# EAGLE schematic slice (EAGLE 5.11)

## Sheet 1 of 6
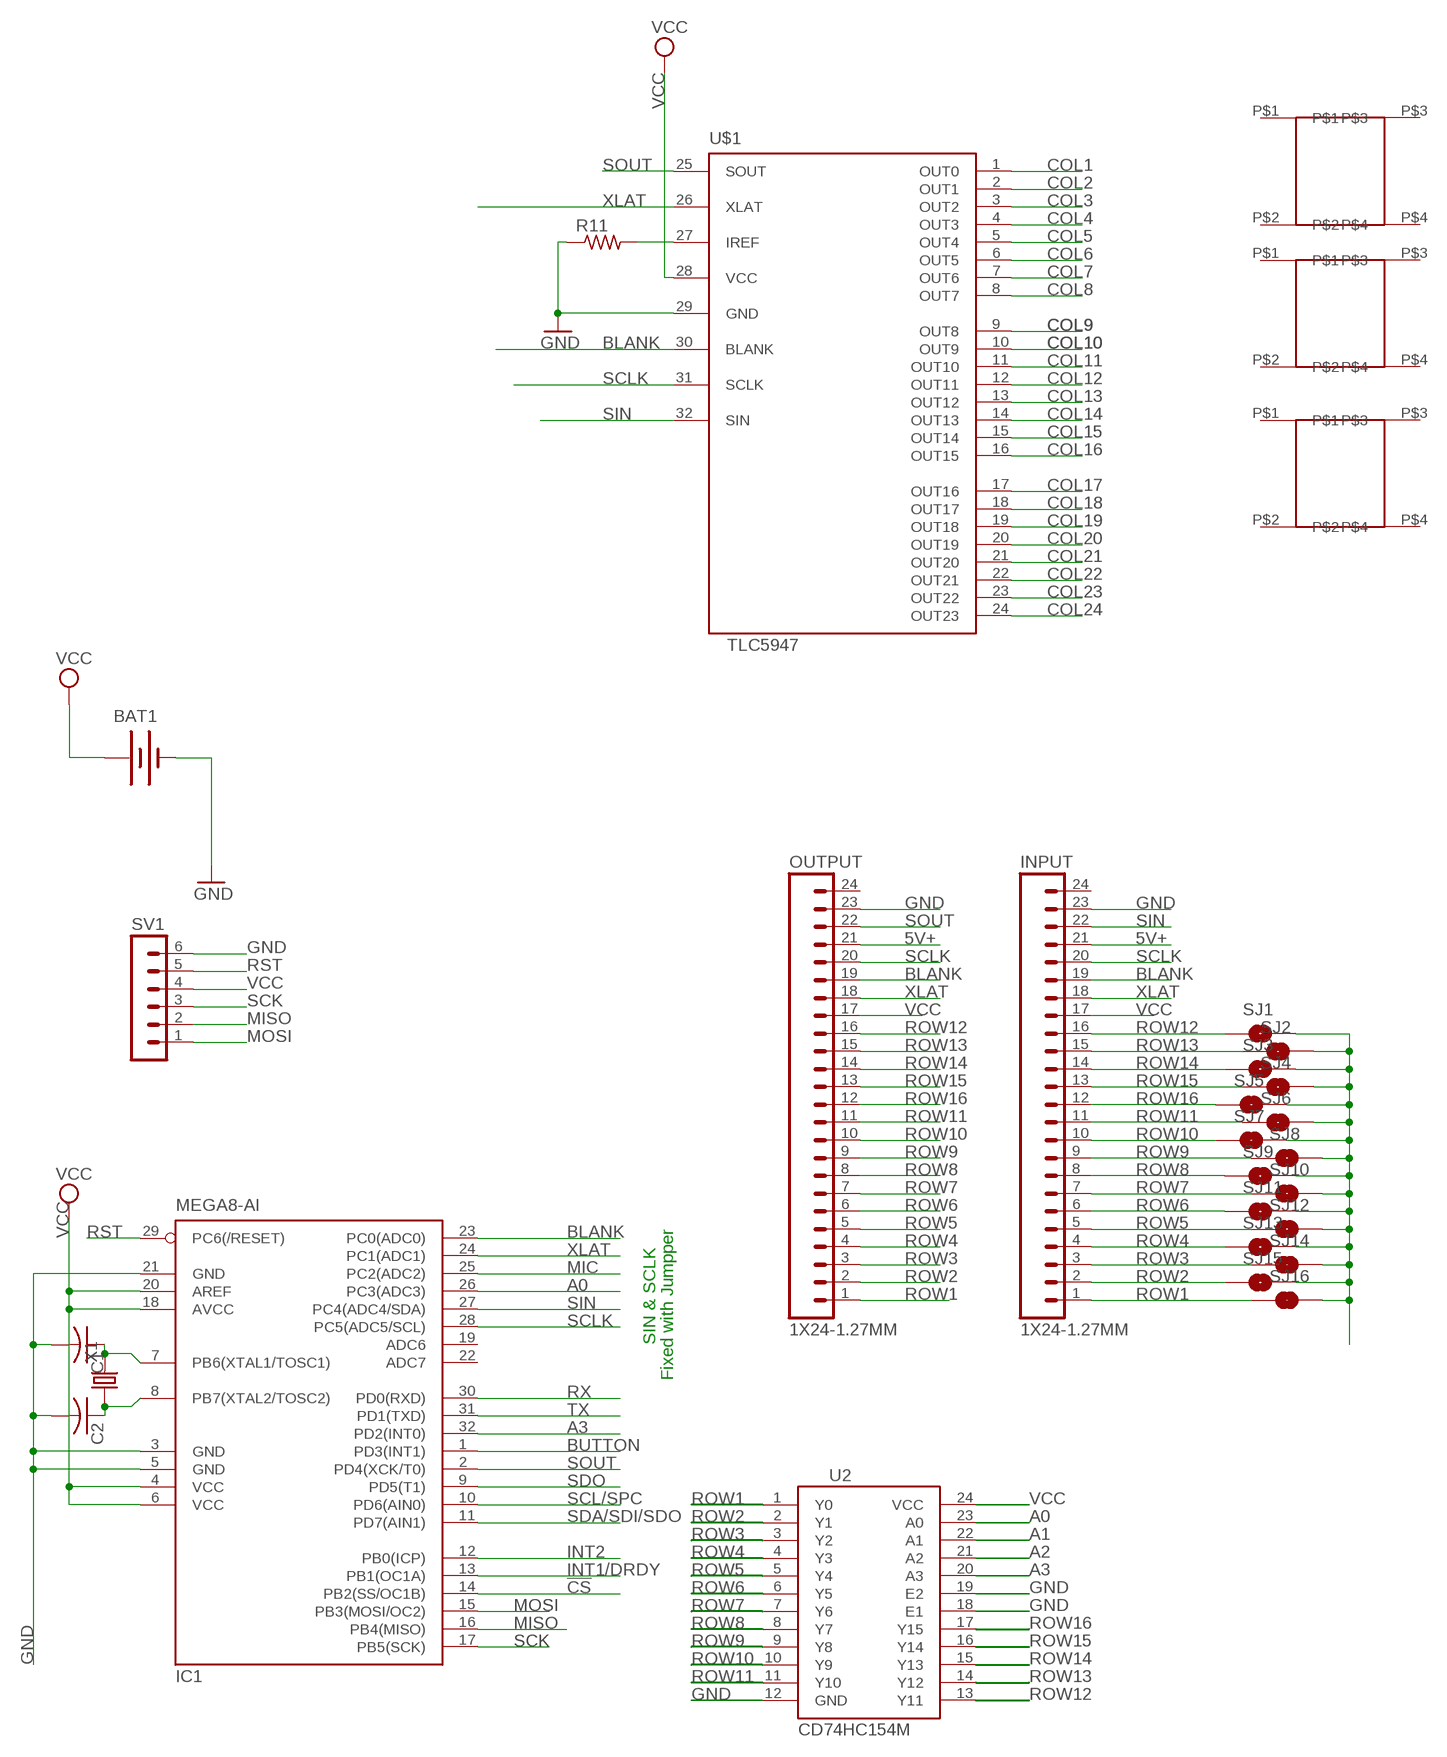
[diagram p0: schematic, sheet 1]

### Parts
BAT1  BATTERY20SMD  [BATTCON_20MM]
C1  C-USC0805  [C0805]
C2  C-USC0805  [C0805]
IC1  MEGA8-AI  [TQFP32-08]
INPUT  1X24-1.27MM  [1X24-1.27MM]
OUTPUT  1X24-1.27MM  [1X24-1.27MM]
R11  R-US_R1206  [R1206]
SJ1  SOLDERJUMPERNO  [SJ_2S-NO]
SJ2  SOLDERJUMPERNO  [SJ_2S-NO]
SJ3  SOLDERJUMPERNO  [SJ_2S-NO]
SJ4  SOLDERJUMPERNO  [SJ_2S-NO]
SJ5  SOLDERJUMPERNO  [SJ_2S-NO]
SJ6  SOLDERJUMPERNO  [SJ_2S-NO]
SJ7  SOLDERJUMPERNO  [SJ_2S-NO]
SJ8  SOLDERJUMPERNO  [SJ_2S-NO]
SJ9  SOLDERJUMPERNO  [SJ_2S-NO]
SJ10  SOLDERJUMPERNO  [SJ_2S-NO]
SJ11  SOLDERJUMPERNO  [SJ_2S-NO]
SJ12  SOLDERJUMPERNO  [SJ_2S-NO]
SJ13  SOLDERJUMPERNO  [SJ_2S-NO]
SJ14  SOLDERJUMPERNO  [SJ_2S-NO]
SJ15  SOLDERJUMPERNO  [SJ_2S-NO]
SJ16  SOLDERJUMPERNO  [SJ_2S-NO]
SV1  MA06-1  [MA06-1]
U2  CD74HC154M  [SO-24DW]
U$1  TLC5947  [QFN32]
U$2  SLOT  [SLOT]
U$3  SLOT  [SLOT]
U$4  SLOT  [SLOT]
X1  CRYSTAL-5032  [5032]

### Nets
5V+: INPUT.21 OUTPUT.21 ; also sheet 2,4
!CS: IC1.14(PB2(SS/OC1B)) ; also sheet 3
A0: IC1.26(PC3(ADC3)) U2.23(A0)
A1: U2.22(A1)
A2: U2.21(A2)
A3: IC1.32(PD2(INT0)) U2.20(A3)
BLANK: IC1.23(PC0(ADC0)) INPUT.19 OUTPUT.19 U$1.30(BLANK)
BUTTON: IC1.1(PD3(INT1)) ; also sheet 3
COL1: U$1.1(OUT0) ; also sheet 2
COL2: U$1.2(OUT1) ; also sheet 2
COL3: U$1.3(OUT2) ; also sheet 2
COL4: U$1.4(OUT3) ; also sheet 2
COL5: U$1.5(OUT4) ; also sheet 2
COL6: U$1.6(OUT5) ; also sheet 2
COL7: U$1.7(OUT6) ; also sheet 2
COL8: U$1.8(OUT7) ; also sheet 2
COL9: U$1.9(OUT8) ; also sheet 2
COL10: U$1.10(OUT9) ; also sheet 2
COL11: U$1.11(OUT10) ; also sheet 2
COL12: U$1.12(OUT11) ; also sheet 2
COL13: U$1.13(OUT12) ; also sheet 2
COL14: U$1.14(OUT13) ; also sheet 2
COL15: U$1.15(OUT14) ; also sheet 2
COL16: U$1.16(OUT15) ; also sheet 2
COL17: U$1.17(OUT16) ; also sheet 2
COL18: U$1.18(OUT17) ; also sheet 2
COL19: U$1.19(OUT18) ; also sheet 2
COL20: U$1.20(OUT19) ; also sheet 2
COL21: U$1.21(OUT20) ; also sheet 2
COL22: U$1.22(OUT21) ; also sheet 2
COL23: U$1.23(OUT22) ; also sheet 2
COL24: U$1.24(OUT23) ; also sheet 2
GND: BAT1.2(-) C1.2 C2.2 IC1.3(GND) IC1.5(GND) IC1.21(GND) INPUT.23 OUTPUT.23 R11.1 SV1.6 U2.12(GND) U2.18(E1) U2.19(E2) U$1.29(GND) ; also sheet 3,4,5,6
INT1/DRDY: IC1.13(PB1(OC1A)) ; also sheet 3
INT2: IC1.12(PB0(ICP)) ; also sheet 3
MIC: IC1.25(PC2(ADC2)) ; also sheet 6
MISO: IC1.16(PB4(MISO)) SV1.2
MOSI: IC1.15(PB3(MOSI/OC2)) SV1.1
N$7: C1.1 IC1.7(PB6(XTAL1/TOSC1)) X1.2
N$8: C2.1 IC1.8(PB7(XTAL2/TOSC2)) X1.1
N$13: R11.2 U$1.27(IREF)
ROW: SJ1.2 SJ2.2 SJ3.2 SJ4.2 SJ5.2 SJ6.2 SJ7.2 SJ8.2 SJ9.2 SJ10.2 SJ11.2 SJ12.2 SJ13.2 SJ14.2 SJ15.2 SJ16.2 ; also sheet 2
ROW1: INPUT.1 OUTPUT.1 SJ16.1 U2.1(Y0)
ROW2: INPUT.2 OUTPUT.2 SJ15.1 U2.2(Y1)
ROW3: INPUT.3 OUTPUT.3 SJ14.1 U2.3(Y2)
ROW4: INPUT.4 OUTPUT.4 SJ13.1 U2.4(Y3)
ROW5: INPUT.5 OUTPUT.5 SJ12.1 U2.5(Y4)
ROW6: INPUT.6 OUTPUT.6 SJ11.1 U2.6(Y5)
ROW7: INPUT.7 OUTPUT.7 SJ10.1 U2.7(Y6)
ROW8: INPUT.8 OUTPUT.8 SJ9.1 U2.8(Y7)
ROW9: INPUT.9 OUTPUT.9 SJ8.1 U2.9(Y8)
ROW10: INPUT.10 OUTPUT.10 SJ7.1 U2.10(Y9)
ROW11: INPUT.11 OUTPUT.11 SJ6.1 U2.11(Y10)
ROW12: INPUT.16 OUTPUT.16 SJ1.1 U2.13(Y11)
ROW13: INPUT.15 OUTPUT.15 SJ2.1 U2.14(Y12)
ROW14: INPUT.14 OUTPUT.14 SJ3.1 U2.15(Y13)
ROW15: INPUT.13 OUTPUT.13 SJ4.1 U2.16(Y14)
ROW16: INPUT.12 OUTPUT.12 SJ5.1 U2.17(Y15)
RST: IC1.29(PC6(/RESET)) SV1.5
RX: IC1.30(PD0(RXD)) ; also sheet 5
SCK: IC1.17(PB5(SCK)) SV1.3
SCL/SPC: IC1.10(PD6(AIN0)) ; also sheet 3
SCLK: IC1.28(PC5(ADC5/SCL)) INPUT.20 OUTPUT.20 U$1.31(SCLK)
SDA/SDI/SDO: IC1.11(PD7(AIN1)) ; also sheet 3
SDO: IC1.9(PD5(T1)) ; also sheet 3
SIN: IC1.27(PC4(ADC4/SDA)) INPUT.22 U$1.32(SIN)
SOUT: IC1.2(PD4(XCK/T0)) OUTPUT.22 U$1.25(SOUT)
TX: IC1.31(PD1(TXD)) ; also sheet 5
VCC: BAT1.1(+) IC1.4(VCC) IC1.6(VCC) IC1.18(AVCC) IC1.20(AREF) INPUT.17 OUTPUT.17 SV1.4 U2.24(VCC) U$1.28(VCC) ; also sheet 3,4,6
XLAT: IC1.24(PC1(ADC1)) INPUT.18 OUTPUT.18 U$1.26(XLAT)
Unconnected: IC1.19(ADC6) IC1.22(ADC7) INPUT.24 OUTPUT.24 U$2.P$1 U$2.P$2 U$2.P$3 U$2.P$4 U$3.P$1 U$3.P$2 U$3.P$3 U$3.P$4 U$4.P$1 U$4.P$2 U$4.P$3 U$4.P$4

### Notes on the sheet
- SIN & SCLK
- Fixed with Jumpper

## Sheet 2 of 6
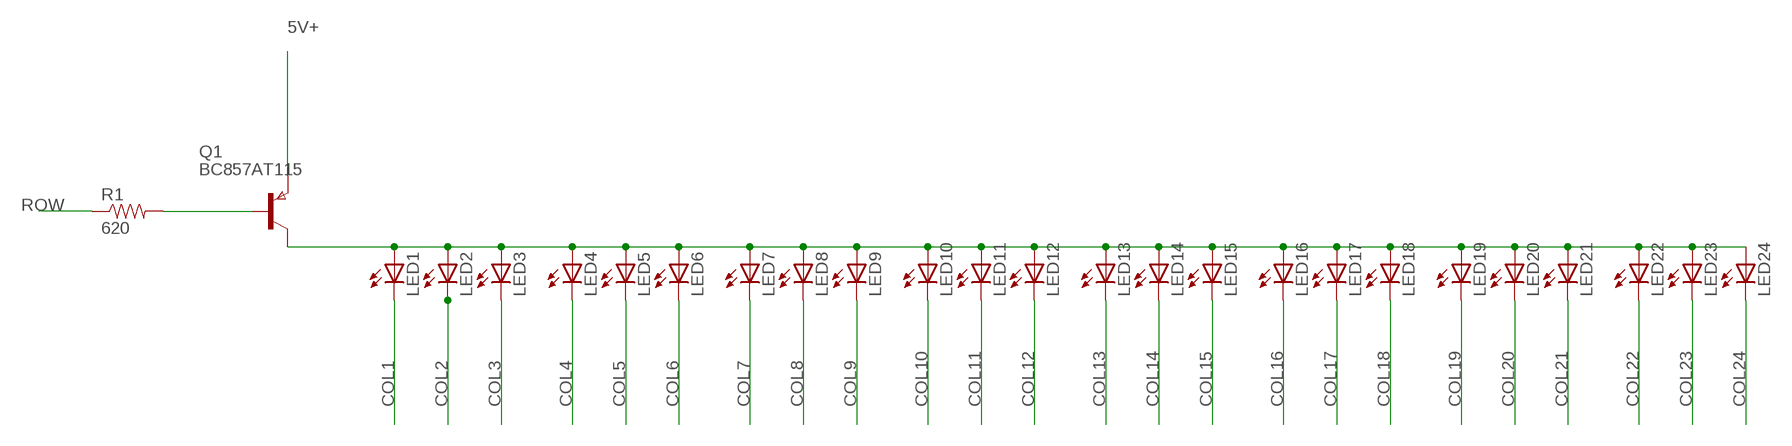
[diagram p1: schematic, sheet 2]

### Parts
LED1  LEDIRL80A  [IRL80A]
LED2  LEDIRL80A  [IRL80A]
LED3  LEDIRL80A  [IRL80A]
LED4  LEDIRL80A  [IRL80A]
LED5  LEDIRL80A  [IRL80A]
LED6  LEDIRL80A  [IRL80A]
LED7  LEDIRL80A  [IRL80A]
LED8  LEDIRL80A  [IRL80A]
LED9  LEDIRL80A  [IRL80A]
LED10  LEDIRL80A  [IRL80A]
LED11  LEDIRL80A  [IRL80A]
LED12  LEDIRL80A  [IRL80A]
LED13  LEDIRL80A  [IRL80A]
LED14  LEDIRL80A  [IRL80A]
LED15  LEDIRL80A  [IRL80A]
LED16  LEDIRL80A  [IRL80A]
LED17  LEDIRL80A  [IRL80A]
LED18  LEDIRL80A  [IRL80A]
LED19  LEDIRL80A  [IRL80A]
LED20  LEDIRL80A  [IRL80A]
LED21  LEDIRL80A  [IRL80A]
LED22  LEDIRL80A  [IRL80A]
LED23  LEDIRL80A  [IRL80A]
LED24  LEDIRL80A  [IRL80A]
Q1  BC857AT115  PNPSOT323SOT416  [SOT416]
R1  620  SPARKFUN_RESISTOR0603-RES  [SPARKFUN_0603-RES]

### Nets
5V+: Q1.3(E) ; also sheet 1,4
COL1: LED1.K(C) ; also sheet 1
COL2: LED2.K(C) ; also sheet 1
COL3: LED3.K(C) ; also sheet 1
COL4: LED4.K(C) ; also sheet 1
COL5: LED5.K(C) ; also sheet 1
COL6: LED6.K(C) ; also sheet 1
COL7: LED7.K(C) ; also sheet 1
COL8: LED8.K(C) ; also sheet 1
COL9: LED9.K(C) ; also sheet 1
COL10: LED10.K(C) ; also sheet 1
COL11: LED11.K(C) ; also sheet 1
COL12: LED12.K(C) ; also sheet 1
COL13: LED13.K(C) ; also sheet 1
COL14: LED14.K(C) ; also sheet 1
COL15: LED15.K(C) ; also sheet 1
COL16: LED16.K(C) ; also sheet 1
COL17: LED17.K(C) ; also sheet 1
COL18: LED18.K(C) ; also sheet 1
COL19: LED19.K(C) ; also sheet 1
COL20: LED20.K(C) ; also sheet 1
COL21: LED21.K(C) ; also sheet 1
COL22: LED22.K(C) ; also sheet 1
COL23: LED23.K(C) ; also sheet 1
COL24: LED24.K(C) ; also sheet 1
LINE1: LED1.A LED2.A LED3.A LED4.A LED5.A LED6.A LED7.A LED8.A LED9.A LED10.A LED11.A LED12.A LED13.A LED14.A LED15.A LED16.A LED17.A LED18.A LED19.A LED20.A LED21.A LED22.A LED23.A LED24.A Q1.1(C)
N$2: Q1.2(B) R1.2
ROW: R1.1 ; also sheet 1

## Sheet 3 of 6
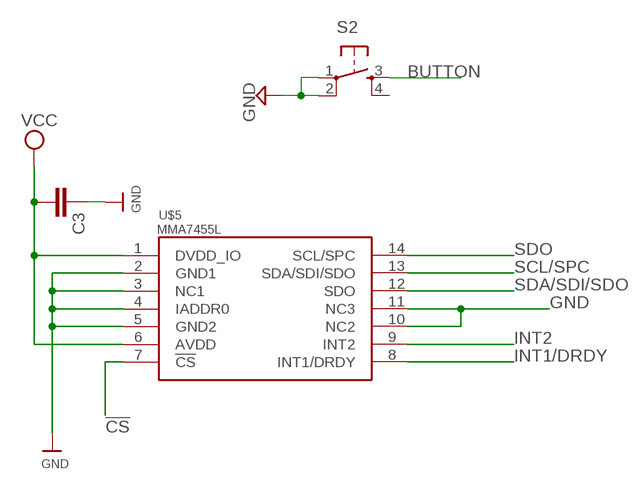
[diagram p2: schematic, sheet 3]

### Parts
C3  CAP0805  [0805]
S2  TAC_SWITCHSMD  [TACTILE_SWITCH_SMD]
U$5  MMA7455L  [LGA-14]

### Nets
!CS: U$5.7(!CS) ; also sheet 1
BUTTON: S2.3 ; also sheet 1
GND: C3.1 S2.1 S2.2 U$5.2(GND1) U$5.3(NC1) U$5.4(IADDR0) U$5.5(GND2) U$5.10(NC2) U$5.11(NC3) ; also sheet 1,4,5,6
INT1/DRDY: U$5.8(INT1/DRDY) ; also sheet 1
INT2: U$5.9(INT2) ; also sheet 1
SCL/SPC: U$5.13(SDA/SDI/SDO) ; also sheet 1
SDA/SDI/SDO: U$5.12(SDO) ; also sheet 1
SDO: U$5.14(SCL/SPC) ; also sheet 1
VCC: C3.2 U$5.1(DVDD_IO) U$5.6(AVDD) ; also sheet 1,4,6
Unconnected: S2.4

## Sheet 4 of 6
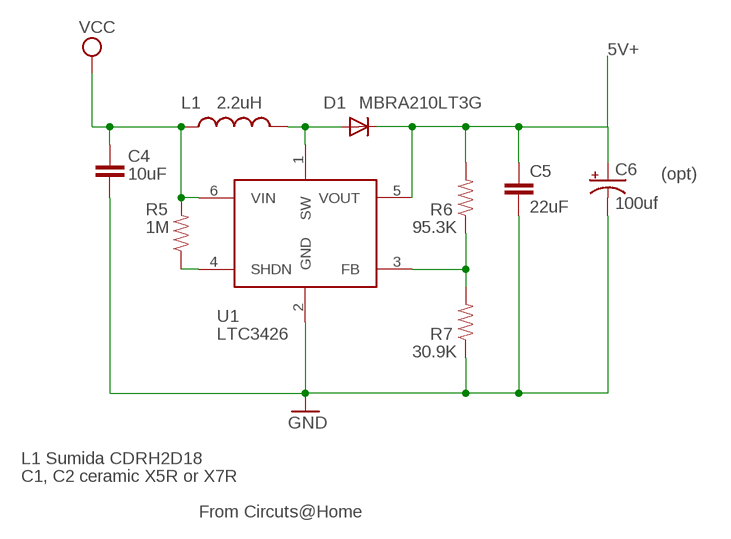
[diagram p3: schematic, sheet 4]

### Parts
C4  10uF  CAP0603  [0603]
C5  22uF  CAP1206  [1206]
C6  100uf  CAP_POL7343  [EIA7343]
D1  MBRA210LT3G  DIODESMA  [SMA-DIODE]
L1  2.2uH  INDUCTOR1313  [1_3X1_3]
R5  1M  RESISTOR0603  [0603]
R6  95.3K  RESISTOR0603  [0603]
R7  30.9K  RESISTOR0603  [0603]
U1  LTC3426  [SOT23-6]

### Nets
5V+: C5.1 C6.A(+) D1.C R6.2 U1.5(VOUT) ; also sheet 1,2
GND: C4.2 C5.2 C6.C(-) R7.1 U1.2(GND) ; also sheet 1,3,5,6
N$1: R5.1 U1.4(SHDN)
N$22: D1.A L1.P$2 U1.1(SW)
N$28: R6.1 R7.2 U1.3(FB)
VCC: C4.1 L1.P$1 R5.2 U1.6(VIN) ; also sheet 1,3,6

### Notes on the sheet
- (opt)
- L1 Sumida CDRH2D18
- C1, C2 ceramic X5R or X7R
- From Circuts@Home

## Sheet 5 of 6
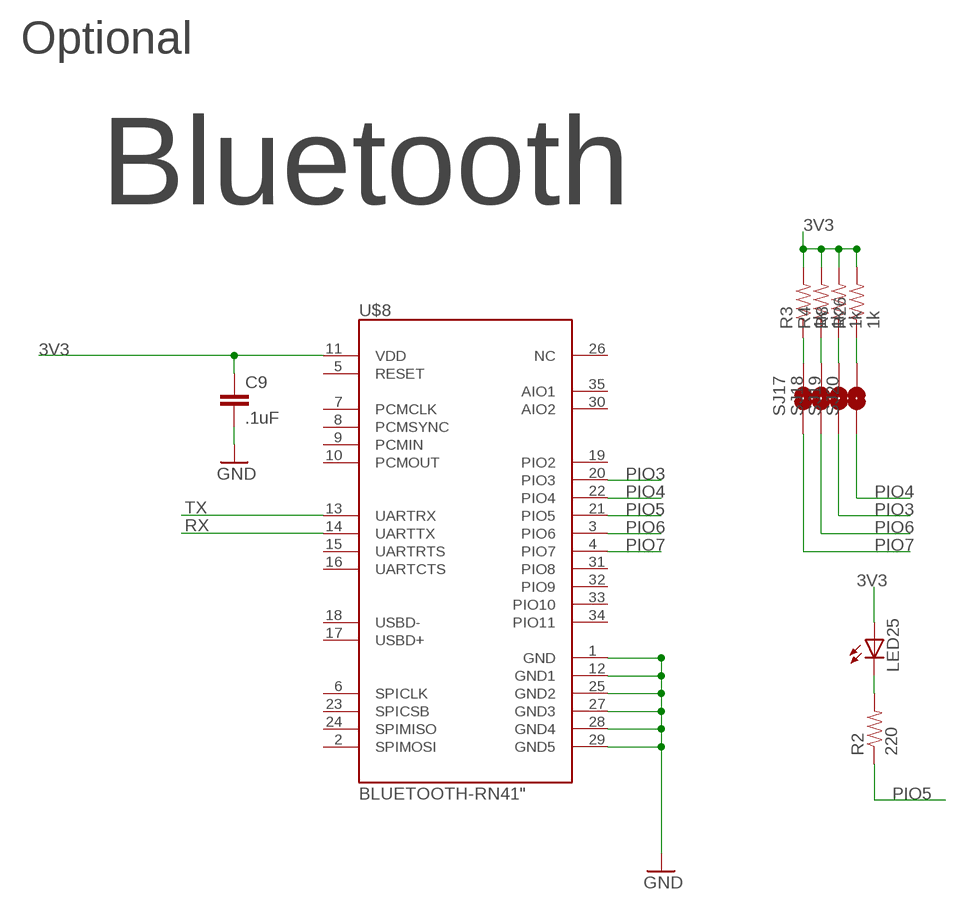
[diagram p4: schematic, sheet 5]

### Parts
C9  .1uF  CAP0805  [0805]
LED25  LEDCHIP-LED0603  [CHIP-LED0603]
R2  220  RESISTOR  [0805]
R3  1k  RESISTOR  [0805]
R4  1k  RESISTOR  [0805]
R8  1k  RESISTOR  [0805]
R26  1k  RESISTOR  [0805]
SJ17  SOLDERJUMPERNO  [SJ_2S-NO]
SJ18  SOLDERJUMPERNO  [SJ_2S-NO]
SJ19  SOLDERJUMPERNO  [SJ_2S-NO]
SJ20  SOLDERJUMPERNO  [SJ_2S-NO]
U$8  BLUETOOTH-RN41"  [RN41]

### Nets
3V3: C9.1 LED25.A R3.2 R4.2 R8.2 R26.2 U$8.11(VDD)
GND: C9.2 U$8.1(GND) U$8.12(GND1) U$8.25(GND2) U$8.27(GND3) U$8.28(GND4) U$8.29(GND5) ; also sheet 1,3,4,6
N$4: LED25.C R2.2
N$5: R3.1 SJ17.2
N$21: R8.1 SJ19.2
N$23: R4.1 SJ18.2
N$24: R26.1 SJ20.2
PIO3: SJ19.1 U$8.20(PIO3)
PIO4: SJ20.1 U$8.22(PIO4)
PIO5: R2.1 U$8.21(PIO5)
PIO6: SJ18.1 U$8.3(PIO6)
PIO7: SJ17.1 U$8.4(PIO7)
RX: U$8.14(UARTTX) ; also sheet 1
TX: U$8.13(UARTRX) ; also sheet 1
Unconnected: U$8.2(SPIMOSI) U$8.5(RESET) U$8.6(SPICLK) U$8.7(PCMCLK) U$8.8(PCMSYNC) U$8.9(PCMIN) U$8.10(PCMOUT) U$8.15(UARTRTS) U$8.16(UARTCTS) U$8.17(USBD+) U$8.18(USBD-) U$8.19(PIO2) U$8.23(SPICSB) U$8.24(SPIMISO) U$8.26(NC) U$8.30(AIO2) U$8.31(PIO8) U$8.32(PIO9) U$8.33(PIO10) U$8.34(PIO11) U$8.35(AIO1)

### Notes on the sheet
- Optional
- Bluetooth

## Sheet 6 of 6
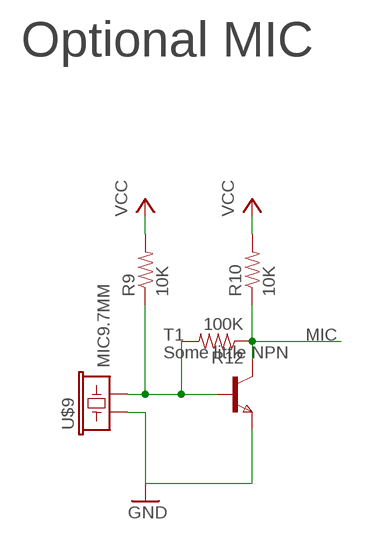
[diagram p5: schematic, sheet 6]

### Parts
R9  10K  RESISTOR  [0805]
R10  10K  RESISTOR  [0805]
R12  100K  RESISTOR  [0805]
T1  Some little NPN  NPNSOT323  [SOT323]
U$9  MIC9.7MM  [MIC-9.7MM]

### Nets
GND: T1.3(E) U$9.1 ; also sheet 1,3,4,5
MIC: R10.1 R12.1 T1.1(C) ; also sheet 1
N$3: R9.1 R12.2 T1.2(B) U$9.2
VCC: R9.2 R10.2 ; also sheet 1,3,4

### Notes on the sheet
- Optional MIC

## Library data of the parts
BAT1 = SparkFun:BATTERY: Battery Holders Various common sizes : AA, AAA, 20mm coin cell and 12mm coin cell.
C1 C2 = rcl:C-US: CAPACITOR, American symbol
C3 C9 = SparkFun:CAP: Capacitor Standard 0603 ceramic capacitor, and 0.1" leaded capacitor.
C4 C5 = CH_passive:CAP: Capacitor Standard 0603 ceramic capacitor, and 0.1" leaded capacitor.
C6 = SparkFun:CAP_POL: Capacitor Polarized These are standard SMD and PTH capacitors. Normally 10uF, 47uF, and 100uF in electrolytic and tantalum varieties. Always verify the external diameter of the through hole cap, it varies with capacity, voltage, and manufacturer. The EIA devices should be standard.
D1 = CH_semiconductors:DIODE: Diode These are standard reverse protection diodes and small signal diodes. SMA package can handle up to about 1A. SOD-323 can handle about 200mA. What the SOD-323 package when ordering, there are some mfgs out there that are 5-pin packages.
IC1 = atmel:MEGA8: MICROCONTROLLER 8 Kbytes FLASH, 1 kbytes SRAM, 512 bytes EEPROM, USART, 6-channel 10 bit ADC, 2-channel 8 bit ADC Pin compatible with Atmega48, ATMega88, ATMega168 Source: avr.lbr; MPN: ATMEGA8-16AU; OC_FARNELL: 9171371; OC_NEWARK: 73M8863
INPUT OUTPUT = slice:1X24-1.27MM
L1 = CH_passive:INDUCTOR: Inductors Basic Inductor/Choke - 0603 and 1206. Footprints are not proven and vary greatly between part numbers.
LED1-LED25 = led:LED: LED OSRAM: - CHIPLED LG R971, LG N971, LY N971, LG Q971, LY Q971, LO R971, LY R971 LH N974, LH R974 LS Q976, LO Q976, LY Q976 LO Q996 - Hyper CHIPLED LW Q18S LB Q993, LB Q99A, LB R99A - SideLED LS A670, LO A670, LY A670, LG A670, LP A670 LB A673, LV A673, LT A673, LW A673 LH A674 LY A675 LS A676, LA A676, LO A676, LY A676, LW A676 LS A679, LY A679, LG A679 - Hyper Micro SIDELED® LS Y876, LA Y876, LO Y876, LY Y876 LT Y87S - SmartLED LW L88C, LW L88S LB L89C, LB L89S, LG L890 LS L89K, LO L89K, LY L89K LS L896, LA L896, LO L896, LY L896 - TOPLED LS T670, LO T670, LY T670, LG T670, LP T670 LSG T670, LSP T670, LSY T670, LOP T670, LYG T670 LG T671, LOG T671, LSG T671 LB T673, LV T673, LT T673, LW T673 LH T674 LS T676, LA T676, LO T676, LY T676, LB T676, LH T676, LSB T676, LW T676 LB T67C, LV T67C, LT T67C, LS T67K, LO T67K, LY T67K, LW E67C LS E67B, LA E67B, LO E67B, LY E67B, LB E67C, LV E67C, LT E67C LW T67C LS T679, LY T679, LG T679 LS T770, LO T770, LY T770, LG T770, LP T770 LB T773, LV T773, LT T773, LW T773 LH T774 LS E675, LA E675, LY E675, LS T675 LS T776, LA T776, LO T776, LY T776, LB T776 LHGB T686 LT T68C, LB T68C - Hyper Mini TOPLED® LB M676 - Mini TOPLED Santana® LG M470 LS M47K, LO M47K, LY M47K Source: http://www.osram.convergy.de LUXEON: - LUMILED® LXK2-PW12-R00, LXK2-PW12-S00, LXK2-PW14-U00, LXK2-PW14-V00 LXK2-PM12-R00, LXK2-PM12-S00, LXK2-PM14-U00 LXK2-PE12-Q00, LXK2-PE12-R00, LXK2-PE12-S00, LXK2-PE14-T00, LXK2-PE14-U00 LXK2-PB12-K00, LXK2-PB12-L00, LXK2-PB12-M00, LXK2-PB14-N00, LXK2-PB14-P00, LXK2-PB14-Q00 LXK2-PR12-L00, LXK2-PR12-M00, LXK2-PR14-Q00, LXK2-PR14-R00 LXK2-PD12-Q00, LXK2-PD12-R00, LXK2-PD12-S00 LXK2-PH12-R00, LXK2-PH12-S00 LXK2-PL12-P00, LXK2-PL12-Q00, LXK2-PL12-R00 Source: www.luxeon.com KINGBRIGHT: KA-3528ASYC Source: www.kingbright.com
Q1 = zetex:PNPSOT323: PNP TRANSISTOR
R1 = Nullspace:SPARKFUN_RESISTOR: Resistor Basic schematic elements and footprints for 0603, 1206, and PTH 1/10th watt (small) resistors.
R2-R4 R8-R10 R12 R26 = SparkFun:RESISTOR: Resistor Basic schematic elements and footprints for 0603, 1206, and PTH 1/10th watt (small) resistors.
R5-R7 = CH_passive:RESISTOR: Resistor Basic schematic elements and footprints for 0603, 1206, and PTH 1/10th watt (small) resistors.
R11 = rcl:R-US_: RESISTOR, American symbol
S2 = SparkFun:TAC_SWITCH: Momentary Switch Button commonly used for reset or general input. Spark Fun Electronics SKU : COM-00097
SJ1-SJ16 = slice:SOLDERJUMPER: Solder Jumper Standard SMD solder jumper. Used to automate production. Two varients : Normally Open and Normally Closed are the same, but have different paste layers. NC will have a large amount of paste and should jumper during reflow.
SJ17-SJ20 = SparkFun:SOLDERJUMPER: Solder Jumper Standard SMD solder jumper. Used to automate production. Two varients : Normally Open and Normally Closed are the same, but have different paste layers. NC will have a large amount of paste and should jumper during reflow.
SV1 = NSL:MA06-1: PIN HEADER
T1 = zetex:NPNSOT323: NPN TRANSISTOR
U1 = CH_Linear_technology:LTC3426
U2 = SparkFun:CD74HC154M: High-Speed CMOS Logic 4- to 16-Line Decoder/Demultiplexer
U$1 = lil_rgb:TLC5947
U$2-U$4 = slice:SLOT
U$5 = MMA7455Lbreakoutboard-v1a:MMA7455L
U$8 = NSL_Mini_Quad:BLUETOOTH-RN41
U$9 = SparkFun:MIC: Microphone Omni-directional electret microphone. 9.7mm standard diameter.
X1 = NSL_MiniQuad:CRYSTAL*: CRYSTAL